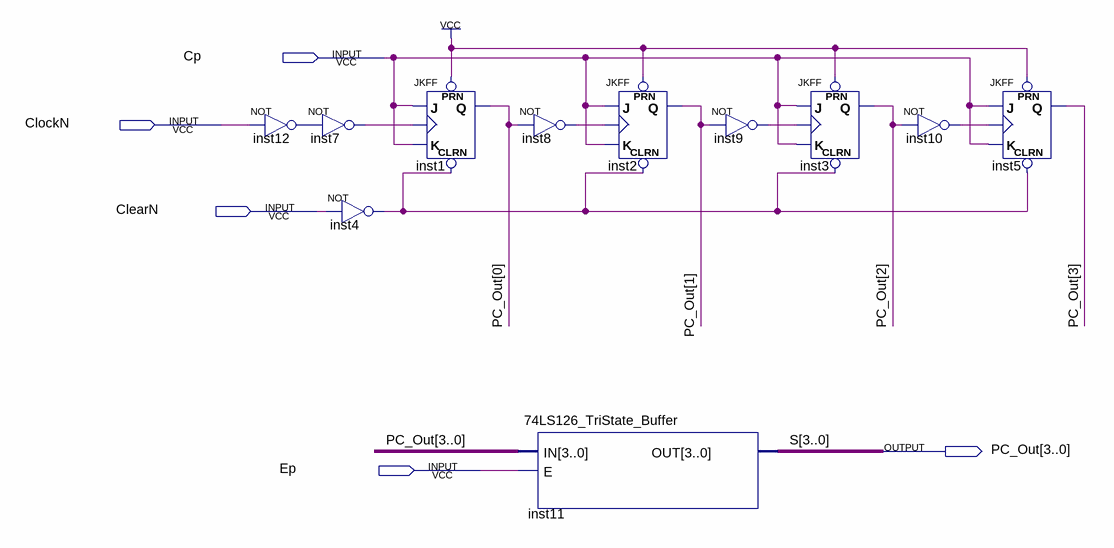
[diagram p0: schematic sheet]
// Quartus schematic Program_Counter.bdf as structural Verilog: 11 symbols, 5 pins
module Program_Counter (
  input  Cp,
  input  ClockN,
  input  ClearN,
  input  Ep,
  output [3:0] PC_Out
);

  wire inst4_out, inst7_out, inst8_out, inst9_out, inst10_out, inst12_out;

  not inst12 (inst12_out, ClockN);
  not inst7 (inst7_out, inst12_out);
  not inst4 (inst4_out, ClearN);
  JKFF inst1 (.PRN(1'b1), .CLRN(inst4_out), .K(Cp), .J(Cp), .CLK(inst7_out), .Q(PC_Out[0]));
  not inst8 (inst8_out, PC_Out[0]);
  \74LS126_TriState_Buffer  inst11 (.IN(PC_Out), .E(Ep), .OUT(PC_Out));
  JKFF inst2 (.PRN(1'b1), .CLRN(inst4_out), .K(Cp), .J(Cp), .CLK(inst8_out), .Q(PC_Out[1]));
  not inst9 (inst9_out, PC_Out[1]);
  JKFF inst3 (.PRN(1'b1), .CLRN(inst4_out), .K(Cp), .J(Cp), .CLK(inst9_out), .Q(PC_Out[2]));
  not inst10 (inst10_out, PC_Out[2]);
  JKFF inst5 (.PRN(1'b1), .CLRN(inst4_out), .K(Cp), .J(Cp), .CLK(inst10_out), .Q(PC_Out[3]));

  // Other names for the same wires on the sheet: S[3:0] = PC_Out
endmodule
